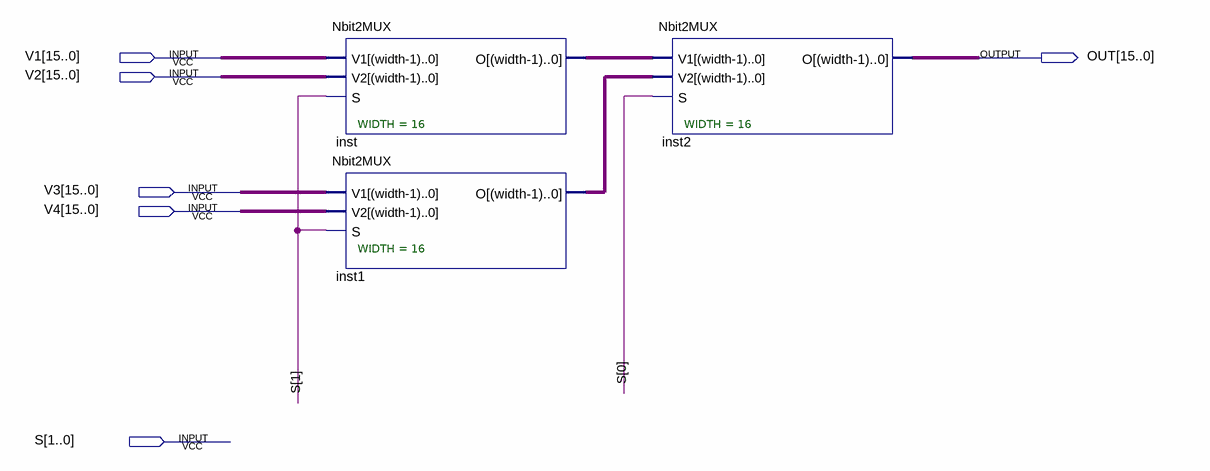
[diagram p0: schematic sheet]
// Quartus schematic 16bit4_1MUX.bdf as structural Verilog: 3 symbols, 6 pins
module \16bit4_1MUX  (
  input  [15:0] V1,
  input  [15:0] V2,
  input  [15:0] V3,
  input  [15:0] V4,
  input  [1:0] S,
  output [15:0] OUT
);

  wire [15:0] inst1_o, inst_o;

  Nbit2MUX #(.WIDTH(16)) inst (.V1(V1), .V2(V2), .S(S[1]), .O(inst_o));
  Nbit2MUX #(.WIDTH(16)) inst1 (.V1(V3), .V2(V4), .S(S[1]), .O(inst1_o));
  Nbit2MUX #(.WIDTH(16)) inst2 (.V1(inst_o), .V2(inst1_o), .S(S[0]), .O(OUT));
endmodule
